# EasyEDA schematic RE5Q_design_2.json
TITLE: Sheet_1; REV: 1.0; Date: 2020-09-14; Sheet: 1/1; Company: Your Company
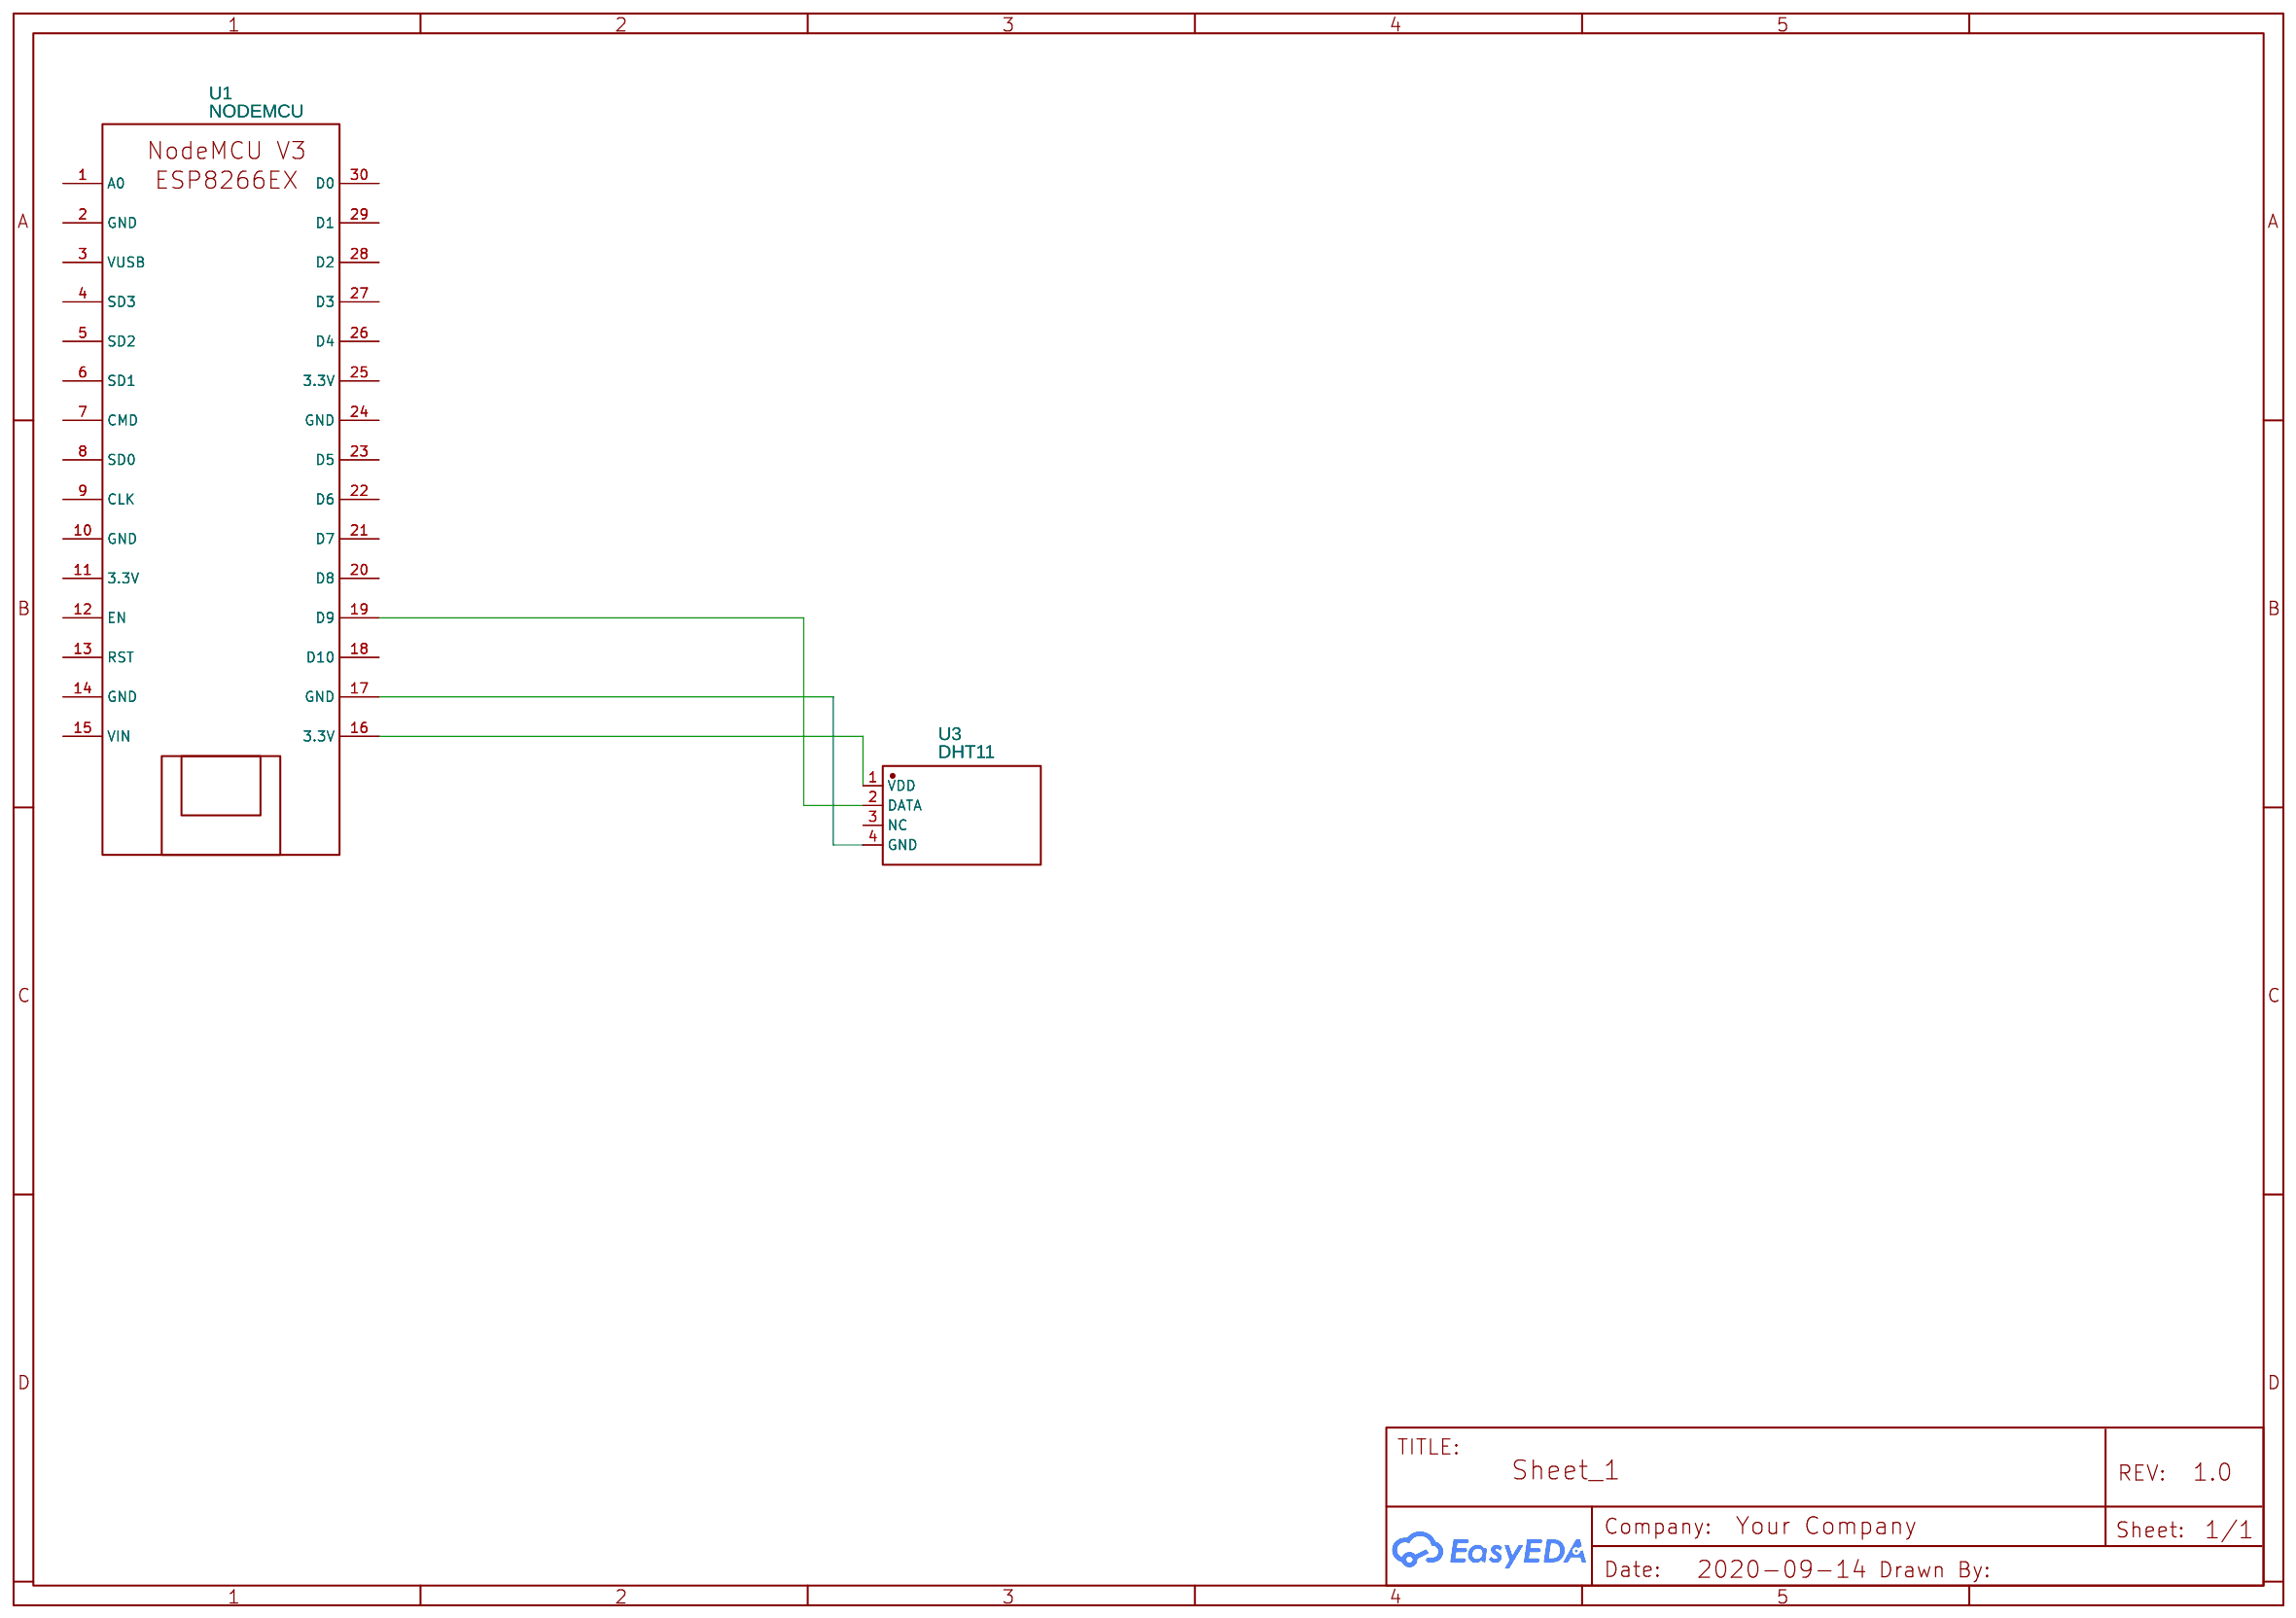
[diagram p0: schematic sheet]

## Parts
U1  NODEMCU  [NODEMCU_V3_ESP8266EX]
U3  DHT11  [DHT11]

## Library data of the parts
U1 = NODEMCU: Contributor: Srinivasan J; sourceId: OGtr1ZXUS; sim: true
U3 = DHT11: Supplier: LCSC; Supplier Part: C117051; Manufacturer: Aosong (Guangzhou) Elec; Contributor: LCSC

## Nets
Net-(U1-16): U1.16(3.3V) U3.1(VDD)
Net-(U1-17): U1.17(GND) U3.4(GND)
Net-(U1-19): U1.19(D9) U3.2(DATA)

Not connected (* = marked no-connect by the designer): U1 1(A0) 2(GND) 3(VUSB) 4(SD3) 5(SD2) 6(SD1) 7(CMD) 8(SD0) 9(CLK) 10(GND) 11(3.3V) 12(EN) 13(RST) 14(GND) 15(VIN) 18(D10) 20(D8) 21(D7) 22(D6) 23(D5) 24(GND) 25(3.3V) 26(D4) 27(D3) 28(D2) 29(D1) 30(D0); U3 3(NC)
